# Altium schematic sheet nguyenly.SchDoc
size A
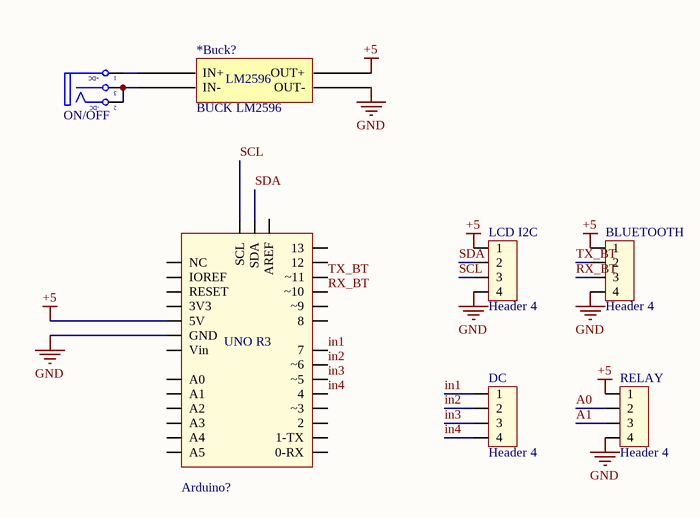
[diagram p0: nguyenly.SchDoc]

## Parts
*Buck?  BUCK LM2596  [BUCK LM2596]
Arduino?  Arduino Uno R3  [Arduino UNO R3]  (value not drawn)
BLUETOOTH  Header 4  [HED4]
DC  Header 4  [HED4]
LCD_I2C  Header 4  [HED4]
ON/OFF  POWER  [DC-IN]  (value not drawn)
RELAY  Header 4  [HED4]

## Nets
+5: *Buck?.4(OUT+) Arduino?.5V BLUETOOTH.1 LCD_I2C.1 RELAY.1
GND: *Buck?.3(OUT-) Arduino?.GND BLUETOOTH.4 LCD_I2C.4 RELAY.4
A0: RELAY.2
A1: RELAY.3
in1: Arduino?.7 DC.1
in2: Arduino?.~6 DC.2
in3: Arduino?.~5 DC.3
in4: Arduino?.4 DC.4
RX_BT: Arduino?.~10 BLUETOOTH.3
SCL: Arduino?.SCL LCD_I2C.3
SDA: Arduino?.SDA LCD_I2C.2
TX_BT: Arduino?.~11 BLUETOOTH.2
Net*Buck?_1: *Buck?.1(IN+) ON/OFF.1(T)
Net*Buck?_2: *Buck?.2(IN-) ON/OFF.2(TN) ON/OFF.3(S)

Not connected (* = marked no-connect by the designer): Arduino? 0-RX 1-TX 2 3V3 8 12 13 A0 A1 A2 A3 A4 A5 AREF IOREF NC RESET Vin ~3 ~9

## Notes on the sheet
- (in symbol Arduino Uno R3) UNO R3
- (in symbol BUCK LM2596) LM2596
- (in symbol DCIN) +DC; -DC

## Library data of the parts
Arduino? = Arduino Uno R3: Value: Cau 1A
BLUETOOTH DC LCD_I2C RELAY = Header 4: Header 4 (Green); Value: Header 4
ON/OFF = DCIN